# EasyEDA Pro project FC_DAP_2026-02-21.epro

# Schematic FC_DAP
Board Name: Board1; Create Date: 2026-01-03; Page Name: P1; Project Name: 莺飞; Schematic Name: Schematic6; Update Date: 2026-01-03; BladeWidth: 10; Company: 嘉立创EDA; Page Size: A4; RegionStart: 1; ShowBorder: 1; TitleBlock: 1; TitleBlockPosition: 3; Version: V1.0; XRegionCount: 6; YRegionCount: 4
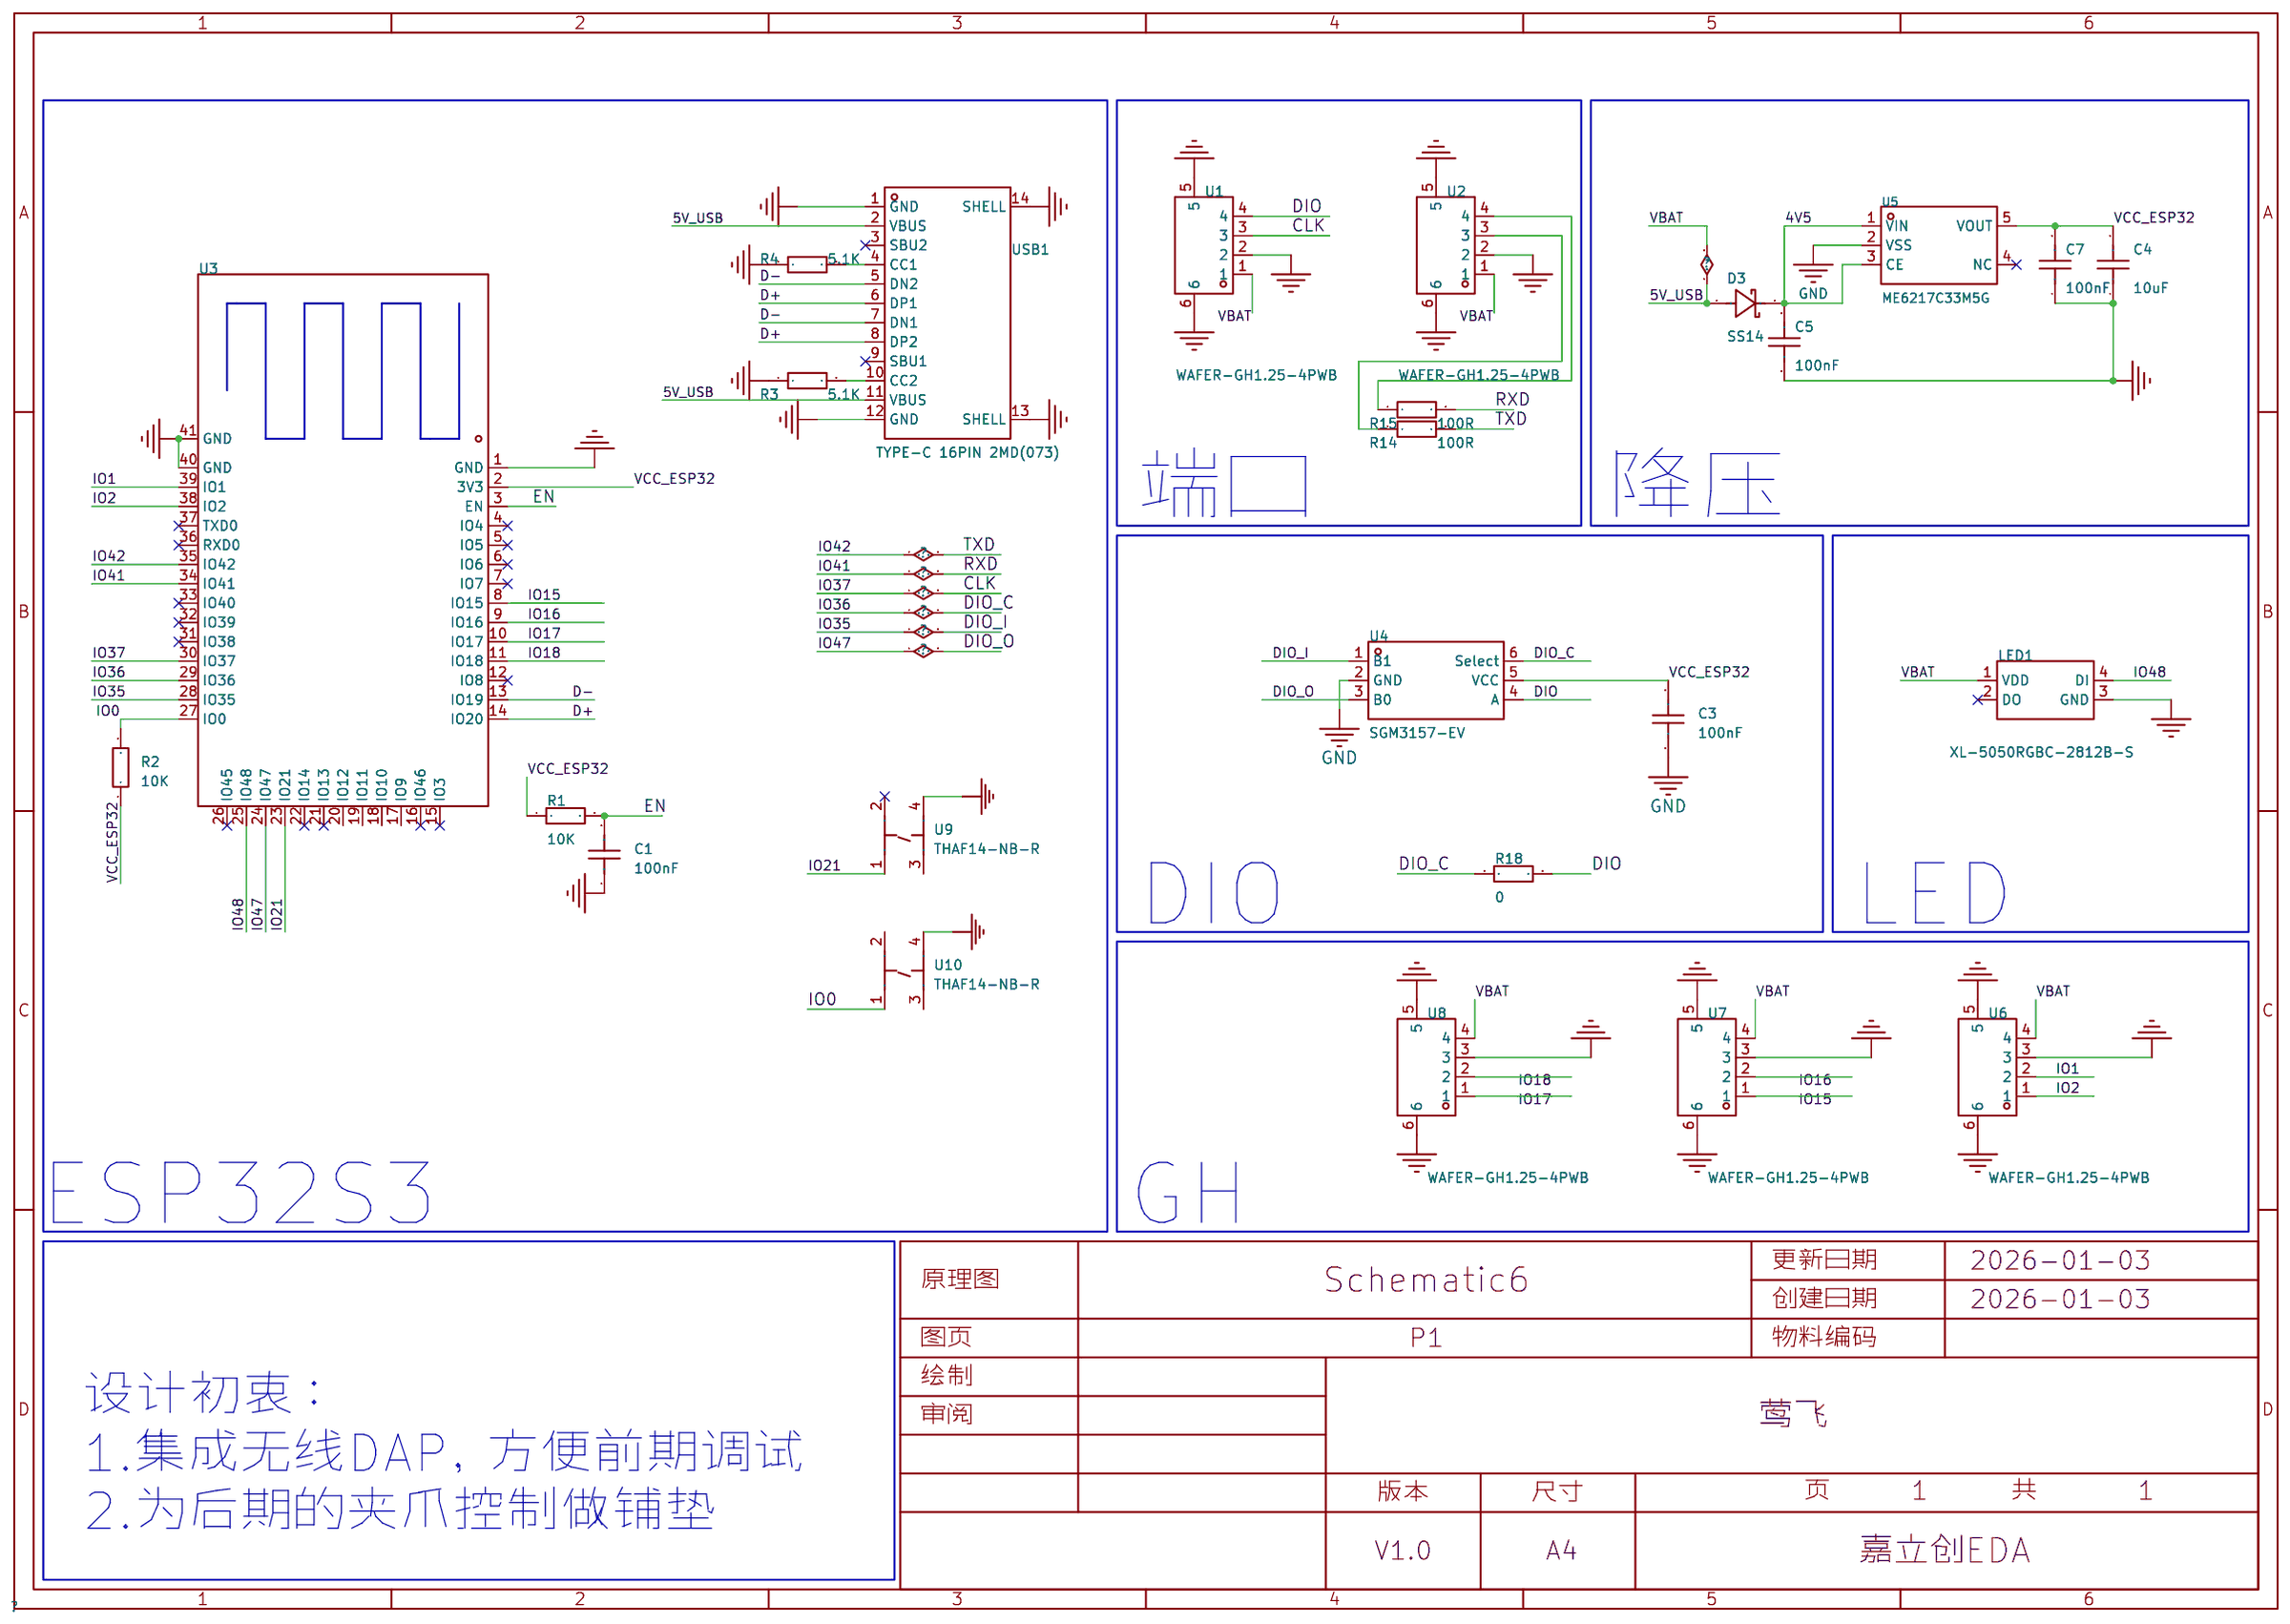
[diagram p0: schematic sheet]

## Parts
C1  100nF  [C0603]
C3  100nF  [C0603]
C4  10uF  [C0603]
C5  100nF  [C0603]
C7  100nF  [C0603]
D3  SS14  [SMA_L4.3-W2.6-LS5.0-FD]
LED1  XL-5050RGBC-2812B-S  [LED-SMD_4P-L5.0-W5.0-TL-1]
R1  10K  [R0603]
R2  10K  [R0603]
R3  5.1K  [R0603]
R4  5.1K  [R0603]
R14  100R  [R0603]
R15  100R  [R0603]
R18  0  [R0603]
U1  WAFER-GH1.25-4PWB  [CONN-SMD_4P-P1.25_XUNPU_WAFER-GH1.25-4PWB]
U2  WAFER-GH1.25-4PWB  [CONN-SMD_4P-P1.25_XUNPU_WAFER-GH1.25-4PWB]
U3  ESP32-S3-WROOM-1-N16R8  [WIRELM-SMD_ESP32-S3-WROOM-1]
U4  SGM3157-EV  [SC-70-6_L2.2-W1.3-P0.65-LS2.1-BL]
U5  ME6217C33M5G  [SOT-23-5_L3.0-W1.7-P0.95-LS2.8-BR]
U6  WAFER-GH1.25-4PWB  [CONN-SMD_4P-P1.25_XUNPU_WAFER-GH1.25-4PWB]
U7  WAFER-GH1.25-4PWB  [CONN-SMD_4P-P1.25_XUNPU_WAFER-GH1.25-4PWB]
U8  WAFER-GH1.25-4PWB  [CONN-SMD_4P-P1.25_XUNPU_WAFER-GH1.25-4PWB]
U9  THAF14-NB-R  [KEY-SMD_4P-L4.7-W3.6-P1.7-LS5.5]
U10  THAF14-NB-R  [KEY-SMD_4P-L4.7-W3.6-P1.7-LS5.5]
USB1  TYPE-C 16PIN 2MD(073)  [USB-C-SMD_TYPE-C-6PIN-2MD-073]

## Library data of the parts
C1 C3-C5 C7 = CAP_0603: Supplier Footprint: 0603
D3 = SS14_C7420316: 二极管配置:独立式;正向压降(Vf):550mV@1.0A;直流反向耐压(Vr):40V;整流电流:1A;; LCSC Part Name: 电压:40V 电流:1A; Supplier Part: C7420316; Manufacturer: R+O(宏嘉诚); Supplier Footprint: SMA(DO-214AC); JLCPCB Part Class: 扩展库; Datasheet: https://item.szlcsc.com/datasheet/SS14/8397138.html; Supplier: LCSC; Diode Configuration: 独立式; Voltage - Forward(Vf@If): 550mV@1.0A; Voltage - DC Reverse(Vr): 40V; Current - Rectified: 1A; Reverse Leakage Current (Ir): 200uA@40V; Operating Junction Temperature Range: -55℃~+150℃; Non-Repetitive Peak Forward Surge Current: 30A
LED1 = XL-5050RGBC-2812B-S: 5050幻彩透明普亮  小芯片  内置驱动 IC  WS2812B; LCSC Part Name: 5050幻彩透明普亮（ws2812b); Supplier Part: C22461793; Manufacturer: XINGLIGHT(成兴光); Supplier Footprint: SMD-4P,5x5mm; JLCPCB Part Class: 扩展库; Datasheet: https://item.szlcsc.com/datasheet/XL-5050RGBC-2812B-S/24144343.html; Supplier: LCSC; Wavelength: B:465nm~475nm；R:620nm~630nm；G:515nm~525nm; Luminous Intensity: G:1000mcd~1400mcd；R:400mcd~600mcd；B:200mcd~400mcd; Fixed-Frequency Pwm Mode: 4kHz; Data Transmission Rate: 800Kbit/s; Voltage - Supply: 3.5V~5.5V; Quiescent Current: 0.6mA; Lens Color: 无色透明透镜; ESD Withstand Voltage: 2000V; Operating Temperature: -40℃~+85℃; Viewing Angle: 120°; Length: 5mm; Width: 1.6mm; Height: 5mm
R1-R4 R14 R15 R18 = Res_0603: Supplier Footprint: 0603
U1 U2 U6-U8 = WAFER-GH1.25-4PWB: 插针结构:1x4P;间距:1.25mm;安装方式:卧贴;参考系列:GH;总PIN数:4P;排数:1;每排PIN数:4;行距:-;额定电流:1A;触头材质:黄铜;触头镀层:-;工作温度范围:-25℃~+85℃;; LCSC Part Name: 1x4P 间距:1.25mm 卧贴 系列:GH; Supplier Part: C3029379; Manufacturer: XUNPU(讯普); Supplier Footprint: SMD,P=1.25mm,卧贴; JLCPCB Part Class: Extended Part; Datasheet: https://atta.szlcsc.com/upload/public/pdf/source/20220527/CB8773BFB0913C3B8ABD62CB38BA101A.pdf; Supplier: LCSC; Pins Structure: 1x4P; Pitch: 1.25mm; Mounting Type: 卧贴; Reference Series: GH; Number of Pins: 4P; Number of Rows: 1; Number of PINs Per Row: 4; Current Rating: 1A; Contact Material: 黄铜; Operating Temperature: -25℃~+85℃; Voltage Rating: 125V; Plastic Material: LCP; Supplementary Features: 辅助焊脚; Color: 米色; Z-Height of the Board: 4.35mm; X-Length of Bottom Edge on Board (Spacing Line): 8.25mm; Y-Width of Bottom Edge on Board: 5mm
U3 = ESP32-S3-WROOM-1-N16R8: LCSC Part Name: 通用型Wi-Fi+低功耗蓝牙MCU模组; Supplier Part: C2913202; Manufacturer: ESPRESSIF(乐鑫); Supplier Footprint: SMD,18x25.5mm; JLCPCB Part Class: 扩展库; Datasheet: https://atta.szlcsc.com/upload/public/pdf/source/20220705/4E799F39581577F766659887F738A439.pdf; Supplier: LCSC
U4 = SGM3157-EV: 这款高性能模拟开关，采用单刀双掷（SPDT）结构，单一通道设计精简高效。支持宽电压操作，1.65V至5.5V范围内稳定工作，确保广泛兼容性。5.2纳秒的超快速导通时间，让信号传输无缝对接，特别适合于高速信号切换场景。无论是音频、视频还是数据信号，都能实现即时、无损的路由转换，为您的电子设备带来流畅的信号处理体验。; Supplier Part: C28642210; Manufacturer: EVVO(翊欧); Supplier Footprint: SC70-6; JLCPCB Part Class: 扩展库; Datasheet: https://atta.szlcsc.com/upload/public/pdf/source/20240712/29EB80309B44903FB911DA491A580C0B.pdf; Supplier: LCSC
U5 = ME6217C33M5G: 输出类型:固定;输出极性:正;最大输入电压:7V;输出电压:3.3V;输出电流:800mA;电源纹波抑制比(PSRR):65dB@(1kHz);; Supplier Part: C427602; Manufacturer: MICRONE(南京微盟); Supplier Footprint: SOT-23-5; JLCPCB Part Class: 扩展库; Datasheet: https://atta.szlcsc.com/upload/public/pdf/source/20190910/C427602_D4B9162A2E9D9EF57C60010DFDECEF37.pdf; Supplier: LCSC; Output Type: 固定; Output Polarity: 正; Number of Outputs: 1; Maximum Input Voltage: 7V; Output Voltage: 3.3V; Dropout Voltage: 180mV@(300mA); Output Current: 800mA; Power Supply Rejection Ratio (PSRR): 65dB@(1kHz)
U9 U10 = THAF14-NB-R: 按钮形状:方形按钮;作用力:1.8N;开关长度:4.7mm;开关宽度:3.6mm;开关高度:1.6mm;带支架:不带支架;触点电流:50mA;额定电压:12V;带灯:无;工作寿命:10万次;; LCSC Part Name: 中龟侧按/平脚/1.6H/180gf/全黑/无柱/镀银/编带; Supplier Part: C19271024; Manufacturer: jianfu(键富); Supplier Footprint: SMD-4P,4.7x3.6mm; JLCPCB Part Class: Extended Part; Datasheet: https://item.szlcsc.com/datasheet/THAF14-NB-R/20539379.html; Supplier: LCSC; Actuator Style: 方形按钮; Operating Force: 1.8N; Length: 4.7mm; Width: 3.6mm; Switch Height: 1.6mm; with Bracket: 不带支架; Contact Current: 50mA; Voltage Rating: 12V; Actuator/Cap Color: 黑色; With Lamp: 无; Termination Style: SMD接片; Life: 10万次; Operating Temperature: -40℃~+85℃
USB1 = TYPE-C 16PIN 2MD(073): LCSC Part Name: Type-C 母 卧贴; Supplier Part: C2765186; Manufacturer: SHOU HAN(首韩); Supplier Footprint: SMD; JLCPCB Part Class: 扩展库; Datasheet: https://atta.szlcsc.com/upload/public/pdf/source/20211123/39B17C16241EAC15C5E277BDA434118E.pdf; Supplier: LCSC; Connector Type: Type-C; Gender: 母; Number of Ports: 1; Number of Contacts: 16P; Mounting Style: 卧贴; Current Rating - Power (Max): 5A; Operating Temperature Range: -25℃~+85℃

## Nets
4V5: C5.2 D3.2(K) U5.1(VIN) U5.3(CE)
5V_USB: D3.1(A) LED1.1(VDD) U1.1 U2.1 U6.4 U7.4 U8.4 USB1.2(VBUS) USB1.11(VBUS)
GND: C1.1 C3.1 C4.1 C5.1 C7.1 LED1.3(GND) R3.1 R4.1 U1.2 U1.5 U1.6 U2.2 U2.5 U2.6 U3.1(GND) U3.40(GND) U3.41(GND) U4.2(GND) U5.2(VSS) U6.3 U6.5 U6.6 U7.3 U7.5 U7.6 U8.3 U8.5 U8.6 U9.4 U10.4 USB1.1(GND) USB1.12(GND) USB1.13(SHELL) USB1.14(SHELL)
VCC_ESP32: C3.2 C4.2 C7.2 R1.1 R2.1 U3.2(3V3) U4.5(VCC) U5.5(VOUT)
CLK: U1.3 U3.30(IO37)
D+: U3.14(IO20) USB1.6(DP1) USB1.8(DP2)
D-: U3.13(IO19) USB1.5(DN2) USB1.7(DN1)
DIO: R18.2 U1.4 U4.4(A)
DIO_C: R18.1 U3.29(IO36) U4.6(Select)
DIO_I: U3.28(IO35) U4.1(B1)
DIO_O: U3.24(IO47) U4.3(B0)
EN: C1.2 R1.2 U3.3(EN)
IO0: R2.2 U3.27(IO0) U10.1
IO1: U3.39(IO1) U6.2
IO2: U3.38(IO2) U6.1
IO15: U3.8(IO15) U7.1
IO16: U3.9(IO16) U7.2
IO17: U3.10(IO17) U8.1
IO18: U3.11(IO18) U8.2
IO21: U3.23(IO21) U9.1
IO41: R15.2 U3.34(IO41)
IO42: R14.2 U3.35(IO42)
IO48: LED1.4(DI) U3.25(IO48)
$1N91: R3.2 USB1.10(CC2)
$1N96: R4.2 USB1.4(CC1)
$1N145: R14.1 U2.3
$1N150: R15.1 U2.4

Not connected (* = marked no-connect by the designer): LED1 2(DO)*; U3 4(IO4)* 5(IO5)* 6(IO6)* 7(IO7)* 12(IO8)* 15(IO3)* 16(IO46)* 17(IO9) 18(IO10) 19(IO11) 20(IO12) 21(IO13)* 22(IO14)* 26(IO45)* 31(IO38)* 32(IO39)* 33(IO40)* 36(RXD0)* 37(TXD0)*; U5 4(NC)*; U9 2* 3; U10 2 3; USB1 3(SBU2)* 9(SBU1)*

## Notes on the sheet
- 端口
- 降压
- DIO
- LED
- ESP32S3
- GH
- 设计初衷：
  1.集成无线DAP，方便前期调试
  2.为后期的夹爪控制做铺垫

# Board FC_DAP
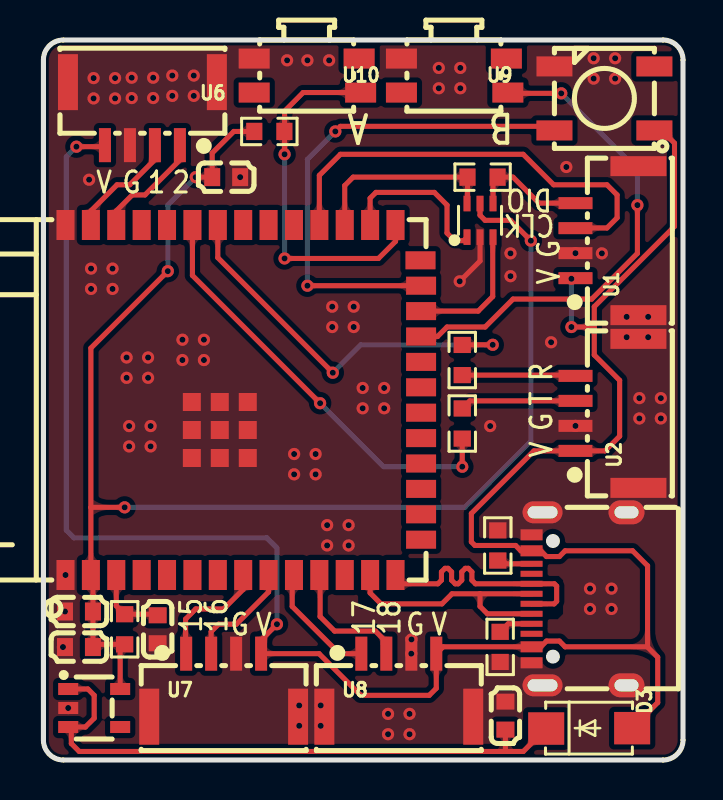
[diagram p1: board, top side]
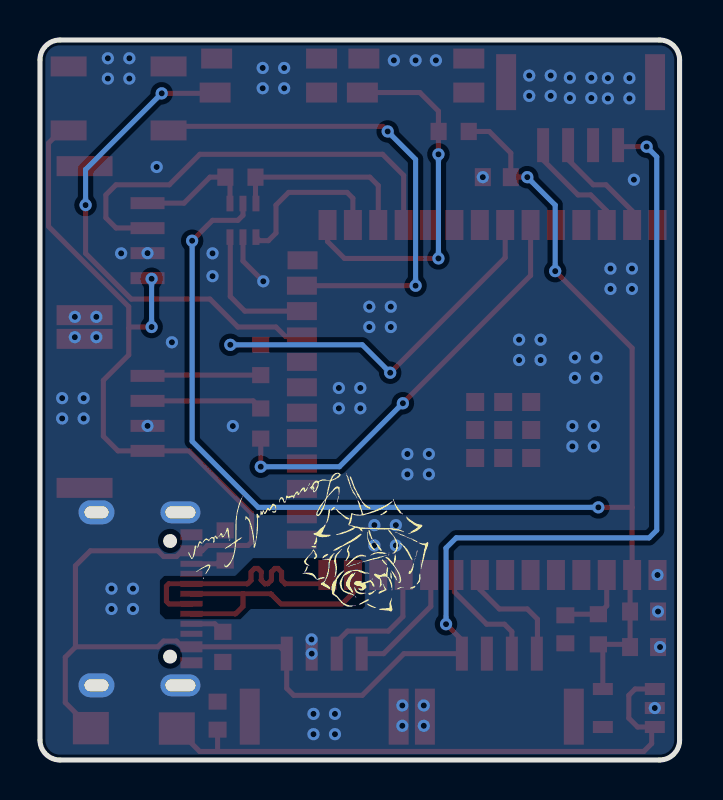
[diagram p2: board, bottom side, seen from below]

Outline 32 x 36 mm; copper layers: Top Layer, Bottom Layer. Coordinates in mm from the lower left corner of the outline.
Outline path: 0,35 0,1 arc(0.29,0.29) 1,0 31,0 arc(31.71,0.29) 32,1 32,35 arc(31.71,35.71) 31,36 1,36 arc(0.29,35.71) 0,35
Stack: Top Layer 0.035mm / Dielectric1 1.51mm FR4 er 4.5 / Bottom Layer 0.035mm

## Design rules (mm)
net D-: DP1
net D+: DP1
spacing copperThickness1oz (default): track to track 0.102, other pairs 0.152 to 0.3
spacing copperThickness2oz: track to track 0.203, other pairs 0.152 to 0.3
track width copperThickness1oz (default): min 0.127, default 0.254, max 2.54
track width copperThickness2oz: min 0.203, default 0.254, max 2.54
differential pair differentialPair (default): width min 0.127, default 0.254, max 2.54; gap min 0.152, default 0.152
net GND uses copperRegion

## Placement (name value [footprint] x y rotation side)
C1  100nF  [C0603]  5.72 6.54 90 top
C3  100nF  [C0603]  9.14 29.14 180 top
C4  10uF  [C0603]  1.78 7.42 0 top
C5  100nF  [C0603]  23.11 2.22 270 top
C7  100nF  [C0603]  1.78 5.65 0 top
D3  SS14  [SMA_L4.3-W2.6-LS5.0-FD]  27.31 1.58 180 top
LED1  XL-5050RGBC-2812B-S  [LED-SMD_4P-L5.0-W5.0-TL-1]  28.07 33.08 180 top
R1  10K  [R0603]  4.06 6.54 90 top
R2  10K  [R0603]  11.3 31.43 0 top
R3  5.1K  [R0603]  22.73 10.73 270 top
R4  5.1K  [R0603]  22.85 5.66 90 top
R14  100R  [R0603]  20.96 16.82 270 top
R15  100R  [R0603]  20.96 20 90 top
R18  0  [R0603]  21.97 29.14 0 top
U1  WAFER-GH1.25-4PWB  [CONN-SMD_4P-P1.25_XUNPU_WAFER-GH1.25-4PWB]  28.19 25.97 90 top
U2  WAFER-GH1.25-4PWB  [CONN-SMD_4P-P1.25_XUNPU_WAFER-GH1.25-4PWB]  28.19 17.33 90 top
U3  ESP32-S3-WROOM-1-N16R8  [WIRELM-SMD_ESP32-S3-WROOM-1]  10 18 90 top
U4  SGM3157-EV  [SC-70-6_L2.2-W1.3-P0.65-LS2.1-BL]  21.84 26.98 0 top
U5  ME6217C33M5G  [SOT-23-5_L3.0-W1.7-P0.95-LS2.8-BR]  2.54 2.6 180 top
U6  WAFER-GH1.25-4PWB  [CONN-SMD_4P-P1.25_XUNPU_WAFER-GH1.25-4PWB]  4.95 32.32 180 top
U7  WAFER-GH1.25-4PWB  [CONN-SMD_4P-P1.25_XUNPU_WAFER-GH1.25-4PWB]  9.02 3.74 0 top
U8  WAFER-GH1.25-4PWB  [CONN-SMD_4P-P1.25_XUNPU_WAFER-GH1.25-4PWB]  17.78 3.74 0 top
U9  THAF14-NB-R  [KEY-SMD_4P-L4.7-W3.6-P1.7-LS5.5]  20.57 34.22 180 top
U10  THAF14-NB-R  [KEY-SMD_4P-L4.7-W3.6-P1.7-LS5.5]  13.21 34.22 180 top
USB1  TYPE-C 16PIN 2MD(073)  [USB-C-SMD_TYPE-C-6PIN-2MD-073]  26.8 8.06 90 top

## Footprints (pads in the part's own frame, mm; a bottom-side part is the same pattern mirrored in y, then rotated)
C0603
  rect 0.8x0.9 smd: 1(-0.7,0) 2(0.7,0)
CONN-SMD_4P-P1.25_XUNPU_WAFER-GH1.25-4PWB
  rect 0.6x1.7 smd: 1(-1.875,1.575) 2(-0.625,1.575) 3(0.625,1.575) 4(1.875,1.575)
  rect 1x2.8 smd: 5(3.725,-1.575) 6(-3.725,-1.575)
KEY-SMD_4P-L4.7-W3.6-P1.7-LS5.5
  rect 1.55x1 smd: 1(-2.663,0.85) 2(2.663,0.85) 3(-2.587,-0.85) 4(2.663,-0.85)
LED-SMD_4P-L5.0-W5.0-TL-1
  rect 1.8x1 smd: 1(-2.5,1.6) 2(-2.5,-1.6) 3(2.5,-1.6) 4(2.5,1.6)
R0603
  rect 0.806x0.864 smd: 1(-0.753,0) 2(0.753,0)
SC-70-6_L2.2-W1.3-P0.65-LS2.1-BL
  rect 0.35x0.78 smd: 1(-0.65,-0.84) 2(0,-0.84) 3(0.65,-0.84) 4(0.65,0.84) 5(0,0.84) 6(-0.65,0.84)
SMA_L4.3-W2.6-LS5.0-FD
  rect 1.8x1.62 smd: 1(-2.15,-0.009) 2(2.15,0.009)
SOT-23-5_L3.0-W1.7-P0.95-LS2.8-BR
  rect 1x0.6 smd: 1(1.3,-0.95) 2(1.3,0) 3(1.3,0.95) 4(-1.3,0.95) 5(-1.3,-0.95)
USB-C-SMD_TYPE-C-6PIN-2MD-073
  rect 0.55x1.1 smd: 1(-3.2,2.375) 2(-2.4,2.375) 11(2.4,2.375) 12(3.2,2.375)
  rect 0.3x1.1 smd: 3(-1.75,2.375) 4(-1.25,2.375) 5(-0.75,2.375) 6(-0.25,2.375) 7(0.25,2.375) 8(0.75,2.375) 9(1.25,2.375) 10(1.75,2.375)
  oval 1.1x2 hole 0.6x1.5: 13(-4.325,1.825) 14(4.325,1.825)
  oval 1.2x1.8 hole 0.6x1.2: 13(-4.325,-2.375) 14(4.325,-2.375)
WIRELM-SMD_ESP32-S3-WROOM-1
  rect 1.5x0.9 smd: 1(-8.75,8.895) 2(-8.75,7.625) 3(-8.75,6.355) 4(-8.75,5.085) 5(-8.75,3.815) 6(-8.75,2.545) 7(-8.75,1.275) 8(-8.75,0.005) 9(-8.75,-1.265) 10(-8.75,-2.535) 11(-8.75,-3.805) 12(-8.75,-5.075) 13(-8.75,-6.345) 14(-8.75,-7.615) 27(8.75,-7.615) 28(8.75,-6.345) 29(8.75,-5.075) 30(8.75,-3.805) 31(8.75,-2.535) 32(8.75,-1.265) 33(8.75,0.005) 34(8.75,1.275) 35(8.75,2.545) 36(8.75,3.815) 37(8.75,5.085) 38(8.75,6.355) 39(8.75,7.625) 40(8.75,8.895)
  rect 0.9x1.5 smd: 15(-6.985,-8.895) 16(-5.715,-8.895) 17(-4.445,-8.895) 18(-3.175,-8.895) 19(-1.905,-8.895) 20(-0.635,-8.895) 21(0.635,-8.895) 22(1.905,-8.895) 23(3.175,-8.895) 24(4.445,-8.895) 25(5.715,-8.895) 26(6.985,-8.865)
  rect 0.9x0.9 smd: 41(-2.9,2.575) 41(-2.9,1.175) 41(-2.9,-0.225) 41(-1.5,2.575) 41(-1.5,1.175) 41(-1.5,-0.225) 41(-0.1,2.575) 41(-0.1,1.175) 41(-0.1,-0.225)

## Nets
As in the schematic.

Pads without a net: LED1 2; U3 4 5 6 7 12 15 16 17 18 19 20 21 22 26 31 32 33 36 37; U5 4; U9 2 3; U10 2 3; USB1 3 9

## Via types
v1: diameter 0.61, hole 0.305, Top Layer to Bottom Layer, 110 vias

## Routing (per net, layer and track width the routed paths; a pad name or vN(x,y) marks a point on that pad's centre or on a via; arc(x,y) is an arc through that point)
4V5: length 30.4
  Top Layer w0.254: 1.37,1.65 2.1,1.65 2.54,2.09 2.54,3.23 2.22,3.55 U5.1 ; 1.37,1.65 U5.3 ; 1.37,1.65 1.4,1.62 1.4,0.82 1.79,0.43 23.15,0.43 ; 23.15,0.43 23.11,0.47 C5.2 ; 23.15,0.43 24.01,0.43 D3.2
5V_USB: length 110.4
  Top Layer w0.254: 27.56,21.59 27.5,21.65 v1(26.42,21.65) ; 27.56,21.59 27.56,20.25 28.83,18.98 28.83,16.19 28.1,15.46 24.54,15.46 21.41,12.33 21.41,10.91 21.59,10.73 23.62,10.73 23.89,10.46 USB1.11 24.88,10.46 25.17,10.17 25.81,10.17 26.1,10.46 29.48,10.46 30.23,9.71 30.23,5.67 30.21,5.66 ; 27.56,21.59 27.56,22.67 31.57,26.68 31.57,30.84 30.94,31.48 LED1.1 ; v1(1.65,30.67) 3,30.67 U6.4 ; 30.21,5.66 26.1,5.66 25.81,5.95 25.17,5.95 24.88,5.66 USB1.2 20,5.66 U8.4 19.66,3.58 19.3,3.23 15.88,3.23 13.79,5.32 U7.4 10.89,6 v1(11.68,6.79) ; 30.21,5.66 30.73,5.14 30.73,2.87 D3.1
  Bottom Layer w0.254: v1(11.68,6.79) 11.68,10.6 11.18,11.11 1.52,11.11 1.14,11.49 1.14,30.16 v1(1.65,30.67) ; v1(26.42,21.65) v1(26.42,24.06)
GND: length 2.6
  Top Layer w0.254: U4.2 21.84,24.95 v1(20.83,23.94)
  vias: v1(0.98,5.65) v1(1.1,9.25) v1(1.08,7.42) v1(1.24,2.6) v1(2.29,29.02) v1(2.38,24.57) v1(2.38,23.55) v1(2.51,34.09) v1(2.51,33.08) v1(3.46,24.57) v1(3.46,23.55) v1(3.59,34.09) v1(3.59,33.08) v1(4.16,20.12) v1(4.16,19.11) v1(4.29,16.7) v1(4.29,15.68) v1(4.42,34.11) v1(4.42,33.1) v1(5.24,20.12) v1(5.24,19.11) v1(5.36,16.7) v1(5.36,15.68) v1(5.49,34.11) v1(5.49,33.1) v1(6.45,34.22) v1(6.45,33.21) v1(6.96,21.01) v1(6.96,20) v1(7.52,34.22) v1(7.52,33.21) v1(8.03,21.01) v1(8.03,20) v1(9.84,29.14) v1(12.19,34.98) v1(12.54,15.3) v1(12.54,14.28) v1(12.8,2.73) v1(12.8,1.71) v1(13.21,34.98) v1(13.62,15.3) v1(13.62,14.28) v1(13.87,2.73) v1(13.87,1.71) v1(14.19,11.74) v1(14.19,10.73) v1(14.29,34.98) v1(14.45,22.67) v1(14.45,21.65) v1(15.27,11.74) v1(15.27,10.73) v1(15.52,22.67) v1(15.52,21.65) v1(15.97,18.6) v1(15.97,17.58) v1(17.05,18.6) v1(17.05,17.58) v1(17.24,2.31) v1(17.24,1.29) v1(18.32,2.31) v1(18.32,1.29) v1(18.41,6.03) v1(18.41,5.32) v1(19.78,34.6) v1(19.78,33.59) v1(20.86,34.6) v1(20.86,33.59) v1(22.35,16.7) v1(23.37,25.33) v1(23.37,24.19) v1(25.4,20.89) v1(26.16,29.65) v1(26.62,25.34) v1(26.62,16.71) v1(27.35,8.57) v1(27.35,7.55) v1(27.53,35.09) v1(27.53,34.07) v1(27.94,25.33) v1(28.42,8.57) v1(28.42,7.55) v1(28.6,35.09) v1(28.6,34.07) v1(29.18,22.16) v1(29.18,21.14) v1(29.82,18.09) v1(29.82,17.08) v1(30.26,22.16) v1(30.26,21.14) v1(30.89,18.09) v1(30.89,17.08)
VCC_ESP32: length 71.3
  Top Layer w0.254: U4.5 21.84,27.24 22.1,26.98 23.37,26.98 v1(24.39,25.96) ; 2.38,12.63 2.38,20.59 v1(6.22,24.44) ; 2.38,12.63 2.38,12.63 v1(4.06,12.63) ; 2.38,12.63 U3.2 2.48,9.15 C4.2 C7.2 2.61,5.78 R1.1 3.84,5.56 U5.5 ; v1(7.62,29.14) C3.2 8.44,30.35 9.53,31.43 R2.1
  Bottom Layer w0.254: v1(24.39,25.96) 24.39,15.94 21.08,12.63 v1(4.06,12.63) ; v1(7.62,29.14) 6.22,27.75 v1(6.22,24.44)
CLK: length 22
  Top Layer w0.254: U3.30 13.81,29.23 14.86,30.28 24,30.28 25.53,28.76 28.19,28.76 28.7,28.25 28.7,27.11 28.19,26.6 26.76,26.6 26.75,26.59
D+: length 12.8
  Top Layer w0.254: USB1.6 24.43,7.81 25.55,7.81 25.68,7.93 25.68,8.69 25.56,8.81 USB1.8 21.62,8.81 21.44,8.99 21.44,9.4 21.26,9.58 21.11,9.58 20.93,9.4 20.93,8.99 20.75,8.81 20.6,8.81 20.42,8.99 20.42,9.4 20.24,9.58 20.09,9.58 19.91,9.4 19.91,8.99 19.73,8.81 17.79,8.81 17.62,8.99 U3.14
D-: length 12.8
  Top Layer w0.254: 21.84,8.31 USB1.7 ; 21.84,8.31 21.84,8.31 21.84,7.68 22.21,7.31 USB1.5 ; 21.84,8.31 20.44,8.31 19.94,7.81 16.89,7.81 16.34,8.35 U3.13
DIO: length 6
  Top Layer w0.254: U4.4 22.49,28.91 R18.2 23.5,29.14 24.79,27.84 26.75,27.84
DIO_C: length 9.6
  Top Layer w0.254: U4.6 21.22,27.85 R18.1 15.49,29.14 15.07,28.72 U3.29
DIO_I: length 8.2
  Top Layer w0.254: U3.28 16.34,28.09 16.64,28.38 19.56,28.38 20.19,27.75 20.19,26.35 20.57,25.97 21.02,25.97 U4.1
DIO_O: length 6.9
  Top Layer w0.254: U4.3 22.48,26.13 22.48,23.17 21.75,22.44 U3.24
EN: length 3.8
  Top Layer w0.254: C1.2 5.66,7.29 R1.2 3.65,7.71 U3.3
IO0: length 18.3
  Top Layer w0.254: U3.27 17.62,25.93 16.76,25.08 v1(12.06,25.08) ; U10.1 12.99,33.37 12.06,32.44 12.06,31.44 R2.2 12.06,31.42 v1(12.06,30.28)
  Bottom Layer w0.254: v1(12.06,25.08) v1(12.06,30.28)
IO1: length 5.7
  Top Layer w0.254: U3.39 2.38,27.45 3.68,28.76 4.32,28.76 5.58,30.02 U6.2
IO2: length 5.7
  Top Layer w0.254: U6.1 6.86,30.71 6.86,30.03 5.08,28.25 4.44,28.25 3.65,27.45 U3.38
IO15: length 6
  Top Layer w0.254: U3.8 10,8.53 9.02,7.55 7.62,7.55 7.11,7.04 7.11,5.35 U7.1
IO16: length 5.6
  Top Layer w0.254: U7.2 8.39,6.42 8.76,6.79 9.65,6.79 11.26,8.4 U3.9
IO17: length 6
  Top Layer w0.254: U8.1 14.81,5.32 12.45,7.68 12.45,9.16 U3.10
IO18: length 6.5
  Top Layer w0.254: U8.2 17.16,5.9 16.61,6.45 14.57,6.45 13.84,7.17 13.84,9.21 U3.11
IO21: length 24.8
  Top Layer w0.254: v1(25.91,33.33) 23.28,33.33 U9.1 ; U3.23 19.72,21.17 20.19,21.65 22.1,21.65 23.5,23.05 27.43,23.05 29.72,25.33 v1(29.72,27.75)
  Bottom Layer w0.254: v1(25.91,33.33) 29.72,29.52 v1(29.72,27.75)
IO41: length 19.9
  Top Layer w0.254: v1(22.48,20.76) 20.96,20.76 R15.2 ; U3.34 8.72,25.12 v1(14.48,19.36)
  Bottom Layer w0.254: v1(22.48,20.76) 15.88,20.76 v1(14.48,19.36)
IO42: length 21.4
  Top Layer w0.254: U3.35 7.46,24.23 v1(13.84,17.84) ; v1(20.96,14.66) R14.2
  Bottom Layer w0.254: v1(13.84,17.84) 17.02,14.66 v1(20.96,14.66)
IO48: length 25.1
  Top Layer w0.254: U3.25 v1(13.21,23.72) ; LED1.4 25.36,31.68 14.86,31.68 v1(14.6,31.43)
  Bottom Layer w0.254: v1(13.21,23.72) 13.21,30.03 v1(14.6,31.43)
$1N91: length 1.9
  Top Layer w0.254: 22.73,10.23 23.15,9.81 USB1.10
$1N96: length 1.7
  Top Layer w0.254: USB1.4 23.25,6.81 R4.2
$1N145: length 5.9
  Top Layer w0.254: R14.1 21.33,17.96 26.75,17.96
$1N150: length 5.8
  Top Layer w0.254: R15.1 26.71,19.24 26.75,19.21

## Copper pours and planes (outline as drawn; the poured copper is in the pictures)
GND on Top Layer: -6.98,39.43 37.72,39.43 37.72,-4.64 -6.98,-4.64
GND on Bottom Layer: -3.68,38.79 39.24,38.79 39.24,-4.64 -3.68,-4.64

Small or netless copper shapes (teardrops, artwork), in the pictures only: 108 on Top Layer, 18 on Bottom Layer

## Text on the board
Top Silkscreen Layer: V | G | 1 | 2 | 15 | 16 | 17 | 18 | R | T | DIO | CLK | A | B
